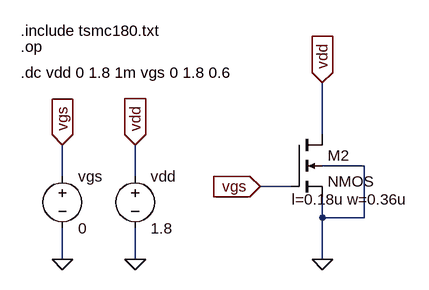
[diagram p0: schematic setup_IdvsVds_nmos.asc]
setup_IdvsVds_nmos.asc, the LTspice schematic file:
Version 4
SHEET 1 880 680
WIRE -272 160 -272 80
WIRE -208 208 -272 208
WIRE -672 224 -672 176
WIRE -560 224 -560 176
WIRE -320 240 -368 240
WIRE -272 288 -272 256
WIRE -208 288 -208 208
WIRE -208 288 -272 288
WIRE -672 352 -672 304
WIRE -560 352 -560 304
WIRE -272 352 -272 288
FLAG -272 352 0
FLAG -672 352 0
FLAG -672 176 vgs
IOPIN -672 176 In
FLAG -368 240 vgs
IOPIN -368 240 In
FLAG -560 352 0
FLAG -560 176 vdd
IOPIN -560 176 In
FLAG -272 80 vdd
IOPIN -272 80 In
SYMBOL nmos4 -320 160 R0
WINDOW 123 1 100 Left 2
SYMATTR Value2 l=0.18u w=0.36u
SYMATTR InstName M2
SYMBOL voltage -672 208 R0
WINDOW 123 0 0 Left 0
WINDOW 39 0 0 Left 0
SYMATTR InstName vgs
SYMATTR Value 0
SYMBOL voltage -560 208 R0
WINDOW 123 0 0 Left 0
WINDOW 39 0 0 Left 0
SYMATTR InstName vdd
SYMATTR Value 1.8
TEXT -736 24 Left 2 !.op
TEXT -736 0 Left 2 !.include tsmc180.txt
TEXT -736 64 Left 2 !.dc vdd 0 1.8 1m vgs 0 1.8 0.6

The netlist it stands for:
* setup_IdvsVds_nmos.asc
M2 vdd vgs 0 0 NMOS l=0.18u w=0.36u
vgs vgs 0 0
vdd vdd 0 1.8
.model NMOS NMOS
.model PMOS PMOS
.lib standard.mos
.op
.include tsmc180.txt
.dc vdd 0 1.8 1m vgs 0 1.8 0.6
.backanno
.end